# EAGLE design krajBB-Priezvisko_Meno (EAGLE 7.7.0)
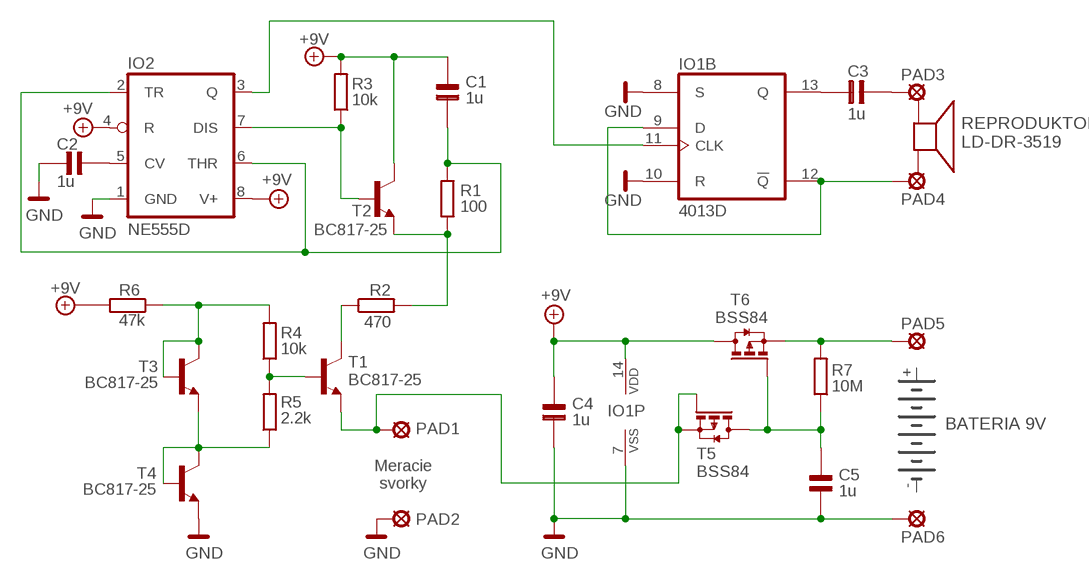
[diagram p0: schematic, sheet 1]

## Parts
C1  1u  C1206TOP  [1206]
C2  1u  C1206TOP  [1206]
C3  1u  C1206TOP  [1206]
C4  1u  C1206TOP  [1206]
C5  1u  C1206TOP  [1206]
IO1  4013D  [SO14]
IO2  NE555D  [SO08]
PAD1  SMD3X3  [SMD3X3]
PAD2  SMD3X3  [SMD3X3]
PAD3  SMD3X3  [SMD3X3]
PAD4  SMD3X3  [SMD3X3]
PAD5  SMD3X3  [SMD3X3]
PAD6  SMD3X3  [SMD3X3]
R1  100  R1206TOP  [1206]
R2  470  R1206TOP  [1206]
R3  10k  R1206TOP  [1206]
R4  10k  R1206TOP  [1206]
R5  2.2k  R1206TOP  [1206]
R6  47k  R1206TOP  [1206]
R7  10M  R1206TOP  [1206]
REPRODUKTOR  LD-DR-3519  [LD-DR-3519]
T1  BC817-25  BC817-25SMD  [SOT23-BEC]
T2  BC817-25  BC817-25SMD  [SOT23-BEC]
T3  BC817-25  BC817-25SMD  [SOT23-BEC]
T4  BC817-25  BC817-25SMD  [SOT23-BEC]
T5  BSS84  [SOT23]
T6  BSS84  [SOT23]
U$1  9VBATTERY  [9VBATTERY]

## Nets
+9V: C1.2 C4.2 IO1.14(P:VDD) IO2.4(R) IO2.8(V+) R3.2 R6.2 T2.C T6.3(D)
GND: C2.1 C4.1 C5.1 IO1.7(P:VSS) IO1.8(B:S) IO1.10(B:R) IO2.1(GND) PAD2.P$1(MP) PAD6.P$1(MP) T4.E
N$1: IO2.7(DIS) R3.1 T2.B
N$2: C1.1 IO2.2(TR) IO2.6(THR) R1.2
N$3: R5.1 T3.E T4.B T4.C
N$4: R1.1 R2.2 T2.E
N$5: R4.2 R6.1 T3.B T3.C
N$6: C2.2 IO2.5(CV)
N$7: IO1.11(B:CLK) IO2.3(Q)
N$8: R4.1 R5.2 T1.B
N$9: R2.1 T1.C
N$10: PAD1.P$1(MP) T1.E T5.1(G) T5.2(S)
N$11: PAD5.P$1(MP) R7.2 T6.2(S)
N$12: IO1.9(B:D) IO1.12(B:!Q) PAD4.P$1(MP)
N$13: C5.2 R7.1 T5.3(D) T6.1(G)
N$15: C3.1 IO1.13(B:Q)
N$16: C3.2 PAD3.P$1(MP)
Unconnected: IO1.1(A:Q) IO1.2(A:!Q) IO1.3(A:CLK) IO1.4(A:R) IO1.5(A:D) IO1.6(A:S) REPRODUKTOR.P$1 REPRODUKTOR.P$2

## Notes on the sheet
- BATERIA 9V
- Meracie
  svorky

## Library data of the parts
C1-C5 = rcl:C1206: 1206 capacitor, top layer
IO1 = 40xx:4013: Dual D FLIP FLOP, set/reset
IO2 = linear:*555: TIMER
PAD1-PAD6 = solpad:SMD3X3
R1-R7 = rcl:R1206: 1206 resistor, top layer
REPRODUKTOR = buzzer:LD-DR-3519
T1-T4 = transistor-npn:BC817*: NPN Transistor
T5 T6 = transistor-small-signal:BSS84: P-CHANNEL MOS FET
U$1 = battery:9VBATTERY: 9V battery symbol and placeholder

## Board
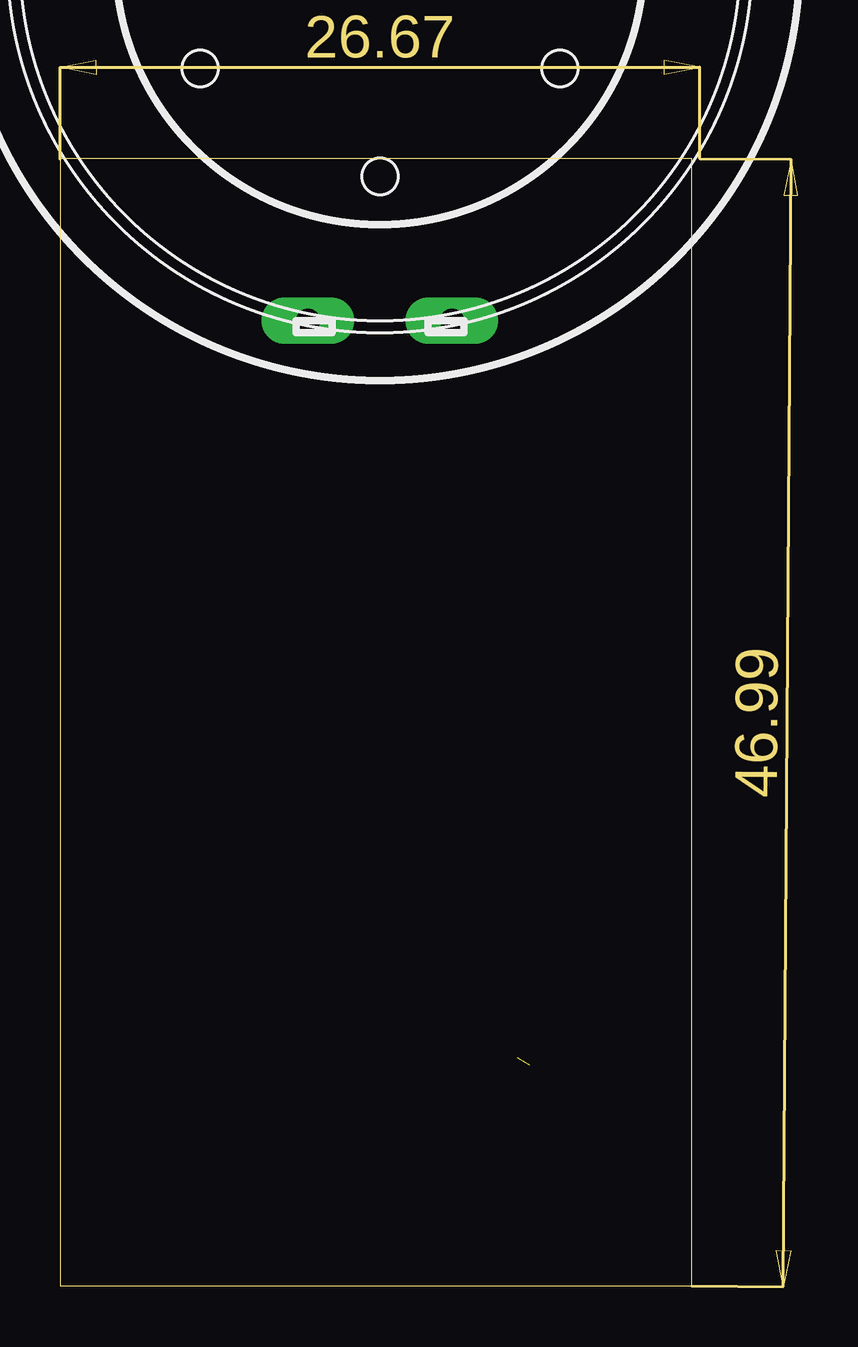
[diagram p1: board, top side]
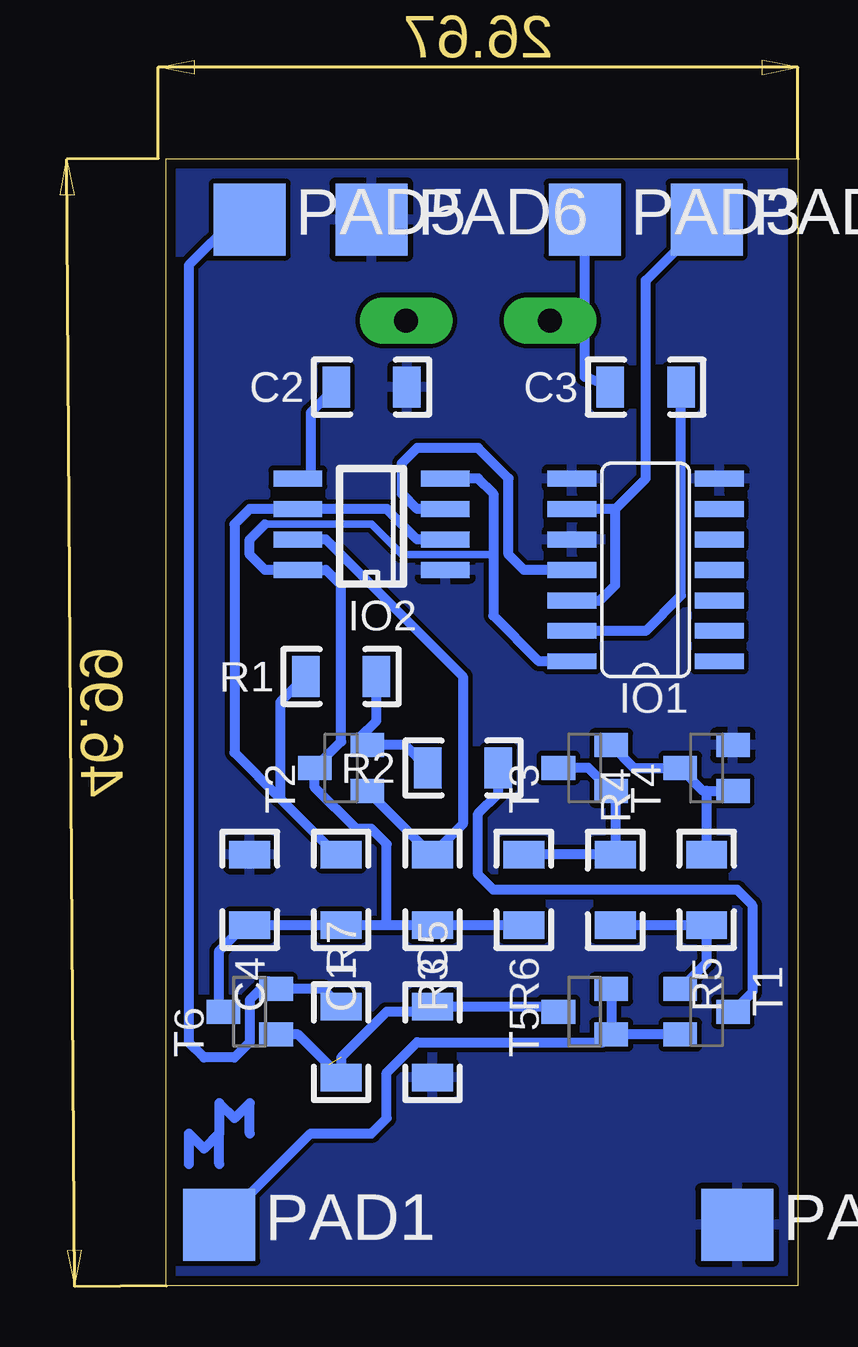
[diagram p2: board, bottom side, seen from below]

Size 26.34 x 46.98 mm. Coordinates in mm from the lower left corner, seen from the top.
Outline: 0,0 26.34,0 26.34,46.98 0,46.98 0,0
Copper layers (1*16): Top 0.035mm / dielectric 1.5mm / Bottom 0.035mm
Design rules "default *": minimum track width 10mil, minimum drill 24mil, track to track 8mil, track to pad 8mil, pad to pad 8mil, via to via 8mil, smd to smd 8mil, copper to edge 16mil, drill to drill 8mil, minimum pad ring 10mil, minimum via ring 8mil, stop-mask expansion 4mil, vias tented up to drill 0mil, thermal gap 10mil

### Footprints (pad centres in the part's own frame; a part is rotated, then mirrored left to right if it is on the bottom)
1206 = smd 1.143 x 1.702: 1 -1.473,0; 2 1.473,0
SO14 = smd 0.66 x 2.032: 1 -3.81,-3.073; 2 -2.54,-3.073; 3 -1.27,-3.073; 4 0,-3.073; 5 1.27,-3.073; 6 2.54,-3.073; 7 3.81,-3.073; 8 3.81,3.073; 9 2.54,3.073; 10 1.27,3.073; 11 0,3.073; 12 -1.27,3.073; 13 -2.54,3.073; 14 -3.81,3.073
SO08 = smd 0.66 x 2.032: 1 -1.905,-3.073; 2 -0.635,-3.073; 3 0.635,-3.073; 4 1.905,-3.073; 5 1.905,3.073; 6 0.635,3.073; 7 -0.635,3.073; 8 -1.905,3.073
SMD3X3 = smd 3 x 3: P$1 0,0
LD-DR-3519 = drill 1 pad 1.93 long: P$1 -3,-15; P$2 3,-15
SOT23-BEC = smd 1 x 1.4: B -0.95,-1.1; C 0,1.1; E 0.95,-1.1
SOT23 = smd 1 x 1.4: 1 -0.95,-1.1; 2 0.95,-1.1; 3 0,1.1

### Placement (x,y rotation side)
C1  19.05,16.51 270 bottom
C2  17.78,37.47 180 bottom
C3  6.35,37.47 180 bottom
C4  22.86,16.51 270 bottom
C5  15.24,10.16 90 bottom
IO1  6.35,29.84 90 bottom
IO2  17.78,31.75 90 bottom
PAD1  24.13,2.54 0 bottom
PAD2  2.54,2.54 0 bottom
PAD3  8.89,44.45 0 bottom
PAD4  3.81,44.45 0 bottom
PAD5  22.86,44.45 0 bottom
PAD6  17.78,44.45 0 bottom
R1  19.05,25.4 180 bottom
R2  13.97,21.59 180 bottom
R3  15.24,16.51 270 bottom
R4  7.62,16.51 90 bottom
R5  3.81,16.51 270 bottom
R6  11.43,16.51 270 bottom
R7  19.05,10.16 90 bottom
REPRODUKTOR  13.34,55.24 0 top
T1  3.81,11.43 270 bottom
T2  19.05,21.59 90 bottom
T3  8.89,21.59 90 bottom
T4  3.81,21.59 90 bottom
T5  8.89,11.43 90 bottom
T6  22.86,11.43 90 bottom
U$1  48.26,24.13 0 top  (outside the outline)

### Tracks (layer width: path | path; a pad name or v marks a point on that pad's centre or on a via)
+9V
  Bottom 0.305: 12.7,30.48 16.51,30.48 17.78,31.75 22.23,31.75
  Bottom 0.406: R6.2 R3.2 17.14,15.04 | 17.14,15.04 C1.2 C4.2 23.06,15.04 24.13,13.97 24.13,11.6 T6.3 | 17.14,15.04 17.14,18.41 17.78,19.05 18.41,19.05 20.15,20.79 T2.C 19.05,22.69 19.05,29.21 19.68,29.84 IO2.8 22.23,29.84 22.86,30.48 22.86,31.11 22.23,31.75 | IO1.14 10.79,26.04 12.7,27.94 12.7,30.48 12.7,33.02 13.34,33.66 IO2.4
GND
  pour Bottom: 0,0 26.67,0 26.67,46.99 0,46.99
N$1
  Bottom 0.406: T2.B 15.29,17.98 R3.1 13.97,19.25 13.97,25.4 19.68,31.11 IO2.7
N$2
  Bottom 0.406: IO2.2 15.88,31.11 17.14,32.38 IO2.6 22.86,32.38 23.5,31.75 23.5,22.23 21.59,20.32 | R1.2 21.59,24.33 21.59,20.32 | 21.59,20.32 19.25,17.98 C1.1
N$3
  Bottom 0.406: T3.E 6.84,21.59 T4.C 3.96,20.64 3.81,20.64 | 3.81,20.64 T4.B | R5.1 3.81,20.64
N$4
  Bottom 0.406: R2.2 16.39,22.54 T2.E 18.27,22.86 17.58,23.55 R1.1
N$5
  Bottom 0.406: R6.1 R4.2 7.62,20.47 T3.B 8.74,21.59 T3.C
N$6
  Bottom 0.406: IO2.5 20.32,33.66 20.32,36.4 C2.2
N$7
  Bottom 0.406: IO1.11 11.43,29.84 12.06,30.48 12.06,33.66 13.34,34.92 15.88,34.92 16.51,34.29 16.51,33.02 15.88,32.38 IO2.3
N$8
  Bottom 0.406: R4.1 R5.2 3.81,13.48 T1.B
N$9
  Bottom 0.406: R2.1 12.5,20.52 13.34,19.68 13.34,17.14 12.7,16.51 2.54,16.51 1.91,15.88 1.91,12.23 T1.C
N$10
  Bottom 0.406: T5.2 T5.1 | T1.E T5.1 | PAD1.P$1 20.32,6.35 17.78,6.35 17.14,6.99 17.14,8.89 15.88,10.16 8.11,10.16 T5.1
N$11
  Bottom 0.406: R7.2 19.8,12.38 T6.2 22.08,12.7 22.86,11.92 22.86,10.16 23.5,9.53 24.77,9.53 25.4,10.16 25.4,42.55 23.5,44.45 PAD5.P$1
N$12
  Bottom 0.406: PAD4.P$1 6.35,41.91 6.35,33.66 7.62,32.38 | 7.62,32.38 IO1.9 | IO1.12 8.26,28.57 7.62,29.21 7.62,32.38
N$13  (1 unrouted)
  Bottom 0.406: 19.57,9.21 20.84,10.48 T6.1 | T5.3 10.19,11.63 C5.2 15.44,11.43 17.14,11.43 19.05,9.53 R7.1
N$14
  Bottom 0.406: 22.86,6.35 22.86,7.62 23.5,6.99 24.13,7.62 24.13,6.35 | 24.13,5.08 24.13,6.35 | 24.13,6.35 24.77,5.71 25.4,6.35 25.4,5.08
N$15
  Bottom 0.406: IO1.13 6.35,27.3 4.88,28.78 C3.1
N$16
  Bottom 0.406: 8.89,41.71 PAD3.P$1 8.89,37.9 C3.2